# Altium schematic sheet Gimbal_Power.SchDoc
size A4
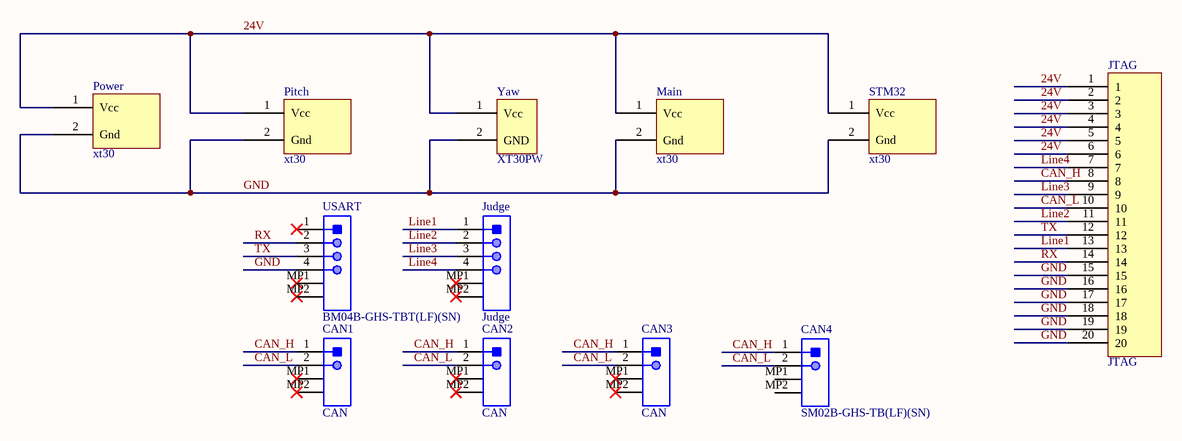
[diagram p0: Gimbal_Power.SchDoc]

## Parts
CAN1  CAN  [JST-SM02B-GHS-TB_V]
CAN2  CAN  [JST-BM02B-GHS-TBT_V]
CAN3  CAN  [JST-BM02B-GHS-TBT_V]
CAN4  SM02B-GHS-TB(LF)(SN)  [JST-SM02B-GHS-TB_V]
JTAG  JTAG  [IDC20S]
Judge  Judge  [JST-BM04B-GHS-TBT_V]
Main  xt30  [XT30]
Pitch  xt30  [XT30]
Power  xt30  [XT30]
STM32  xt30  [XT30]
USART  BM04B-GHS-TBT(LF)(SN)  [JST-BM04B-GHS-TBT_V]
Yaw  XT30PW  [XT30PW]

## Nets
24V: JTAG.1 JTAG.2 JTAG.3 JTAG.4 JTAG.5 JTAG.6 Main.1(Vcc) Pitch.1(Vcc) Power.1(Vcc) STM32.1(Vcc) Yaw.1(Vcc)
CAN_H: CAN1.1 CAN2.1 CAN3.1 CAN4.1 JTAG.8
CAN_L: CAN1.2 CAN2.2 CAN3.2 CAN4.2 JTAG.10
GND: JTAG.15 JTAG.16 JTAG.17 JTAG.18 JTAG.19 JTAG.20 Main.2(Gnd) Pitch.2(Gnd) Power.2(Gnd) STM32.2(Gnd) USART.4 Yaw.2(GND)
Line1: JTAG.13 Judge.1
Line2: JTAG.11 Judge.2
Line3: JTAG.9 Judge.3
Line4: JTAG.7 Judge.4
RX: JTAG.14 USART.2
TX: JTAG.12 USART.3

Not connected (* = marked no-connect by the designer): CAN1 MP1* MP2*; CAN2 MP1* MP2*; CAN3 MP1* MP2*; CAN4 MP1 MP2; Judge MP1* MP2*; USART 1* MP1* MP2*

## Library data of the parts
CAN1 CAN4 = SM02B-GHS-TB(LF)(SN): GH Disconnectable Crimp Style Connector, Pitch 1.25 mm, 1 x 2 Position, Height 4.25 mm, -25 to 85 degC, RoHS, Tape and Reel; Manufacturer: JST; No of Positions: 5; Pitch: 1.25mm; Style/Orientation: StraightHeader/Plug; Package Reference: BM05B-GHS-TBT; Type: WiretoBoard; Datasheet URL: http://www.jst-mfg.com/product/pdf/eng/eGH.pdf; Termination: Crimp; Manufacturer URL: http://www.jst.com/home2.html; Mounting Technology: SurfaceMount; Datasheet Version: 05/2016; Package Description: GH Disconnectable Crimp Style Connector, Pitch 1.25 mm, 1 x 5 Position, Height 4.05 mm
CAN2 CAN3 = BM02B-GHS-TBT(LF)(SN): GH Disconnectable Crimp Style Connector, Pitch 1.25 mm, 1 x 2 Position, Height 4.05 mm, -25 to 85 degC, RoHS, Tape and Reel; Manufacturer: JST; No of Positions: 5; Pitch: 1.25mm; Style/Orientation: StraightHeader/Plug; Package Reference: BM05B-GHS-TBT; Type: WiretoBoard; Datasheet URL: http://www.jst-mfg.com/product/pdf/eng/eGH.pdf; Termination: Crimp; Manufacturer URL: http://www.jst.com/home2.html; Mounting Technology: SurfaceMount; Datasheet Version: 05/2016; Package Description: GH Disconnectable Crimp Style Connector, Pitch 1.25 mm, 1 x 5 Position, Height 4.05 mm
Judge USART = BM04B-GHS-TBT(LF)(SN): GH Disconnectable Crimp Style Connector, Pitch 1.25 mm, 1 x 4 Position, Height 4.05 mm, -25 to 85 degC, RoHS, Tape and Reel; Manufacturer: JST; No of Positions: 5; Pitch: 1.25mm; Style/Orientation: StraightHeader/Plug; Package Reference: BM05B-GHS-TBT; Type: WiretoBoard; Datasheet URL: http://www.jst-mfg.com/product/pdf/eng/eGH.pdf; Termination: Crimp; Manufacturer URL: http://www.jst.com/home2.html; Mounting Technology: SurfaceMount; Datasheet Version: 05/2016; Package Description: GH Disconnectable Crimp Style Connector, Pitch 1.25 mm, 1 x 5 Position, Height 4.05 mm